# EAGLE design lumiled-example (EAGLE 4.16)
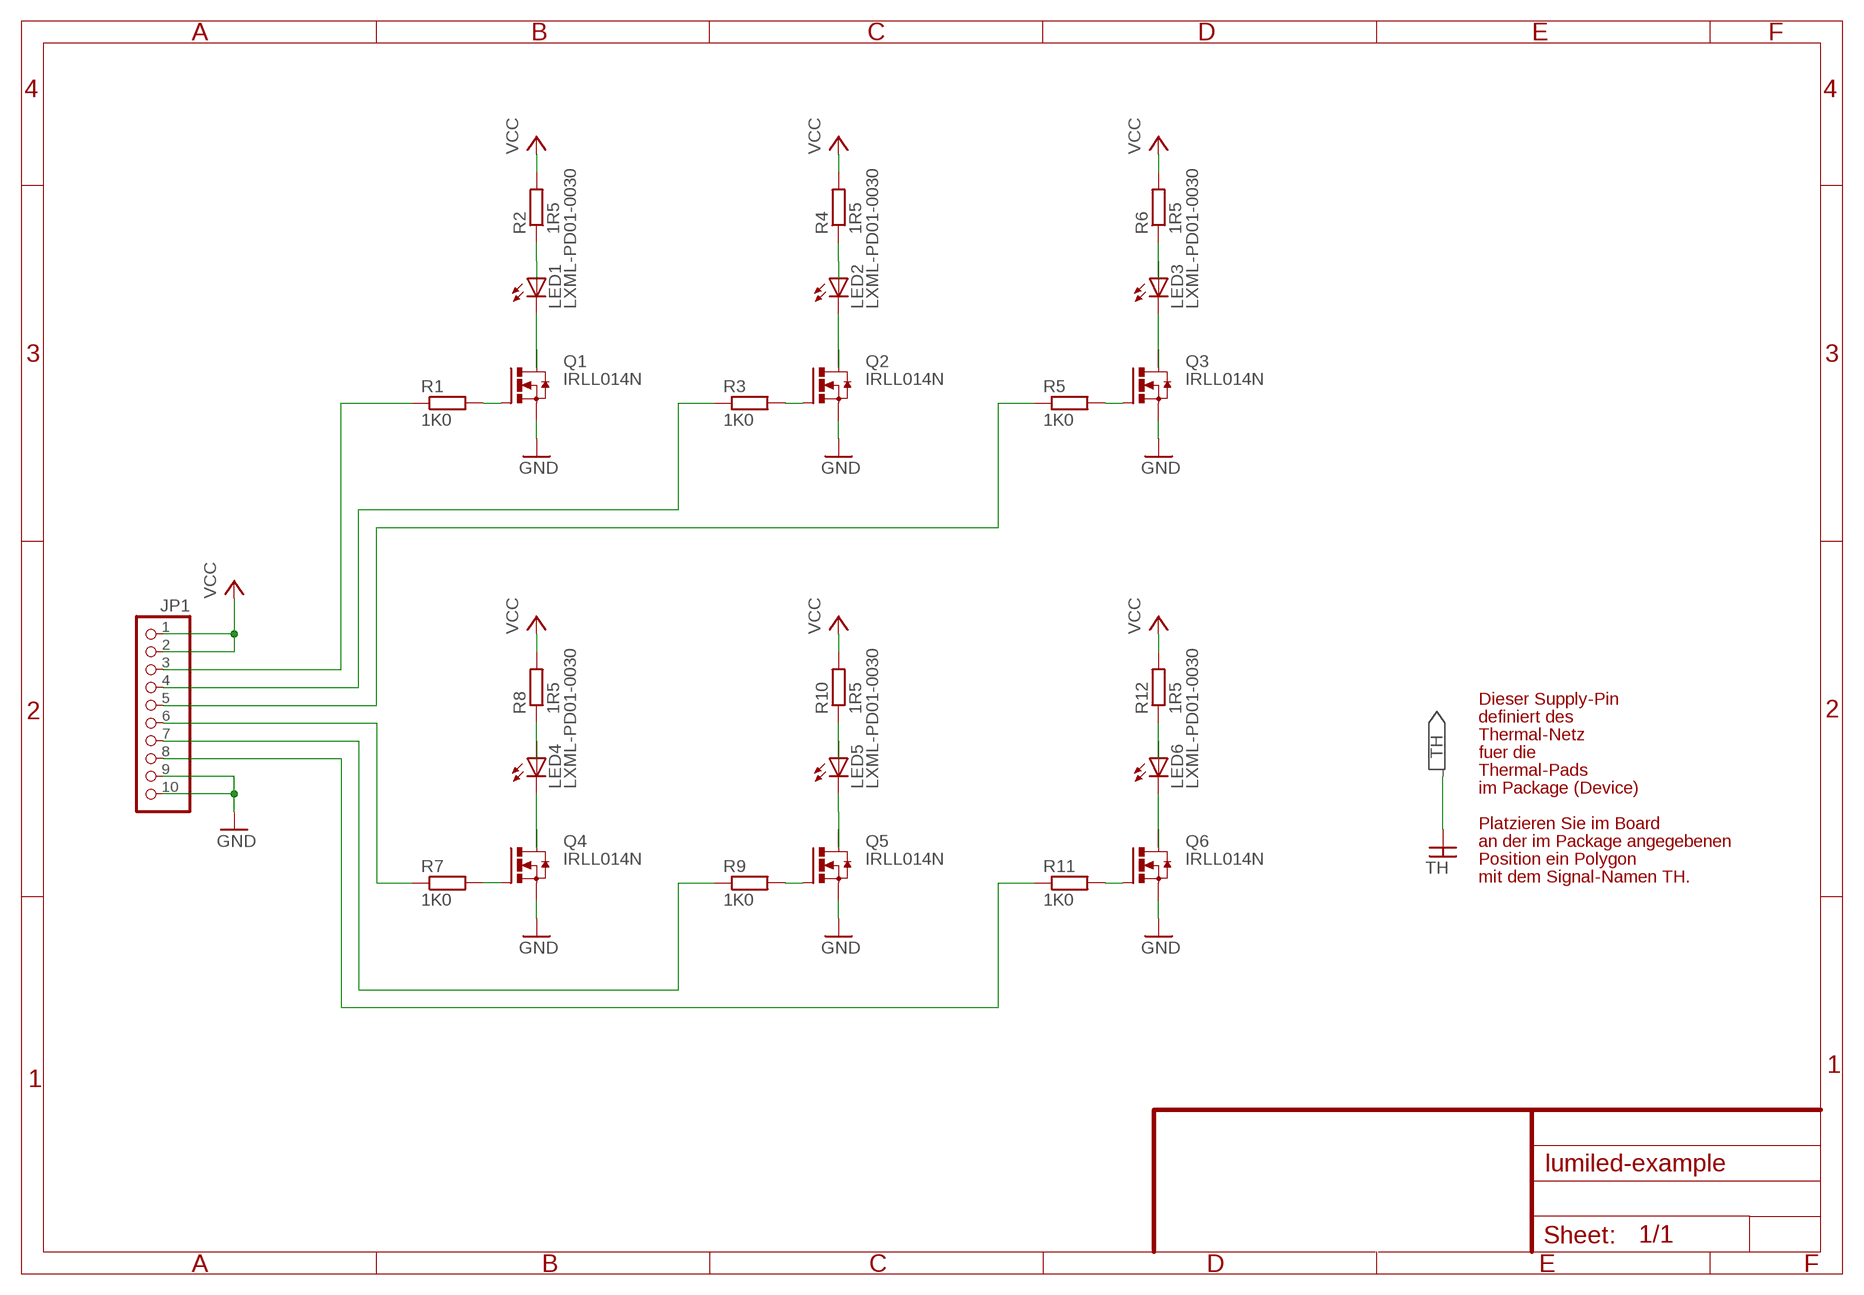
[diagram p0: schematic, sheet 1]

## Parts
JP1  PINHD-1X10  [1X10]
LED1  LXML-PD01-0030  LUXEON_REBEL+COOLPAD  [LUXEON_REBEL+COOLPAD]
LED2  LXML-PD01-0030  LUXEON_REBEL+COOLPAD  [LUXEON_REBEL+COOLPAD]
LED3  LXML-PD01-0030  LUXEON_REBEL+COOLPAD  [LUXEON_REBEL+COOLPAD]
LED4  LXML-PD01-0030  LUXEON_REBEL+COOLPAD  [LUXEON_REBEL+COOLPAD]
LED5  LXML-PD01-0030  LUXEON_REBEL+COOLPAD  [LUXEON_REBEL+COOLPAD]
LED6  LXML-PD01-0030  LUXEON_REBEL+COOLPAD  [LUXEON_REBEL+COOLPAD]
Q1  IRLL014N  N-HEXFET-2D_SOT232-IRLL014N  [SOT223]
Q2  IRLL014N  N-HEXFET-2D_SOT232-IRLL014N  [SOT223]
Q3  IRLL014N  N-HEXFET-2D_SOT232-IRLL014N  [SOT223]
Q4  IRLL014N  N-HEXFET-2D_SOT232-IRLL014N  [SOT223]
Q5  IRLL014N  N-HEXFET-2D_SOT232-IRLL014N  [SOT223]
Q6  IRLL014N  N-HEXFET-2D_SOT232-IRLL014N  [SOT223]
R1  1K0  R-EU_R0603  [R0603]
R2  1R5  R-EU_WSC2515  [WSC2515]
R3  1K0  R-EU_R0603  [R0603]
R4  1R5  R-EU_WSC2515  [WSC2515]
R5  1K0  R-EU_R0603  [R0603]
R6  1R5  R-EU_WSC2515  [WSC2515]
R7  1K0  R-EU_R0603  [R0603]
R8  1R5  R-EU_WSC2515  [WSC2515]
R9  1K0  R-EU_R0603  [R0603]
R10  1R5  R-EU_WSC2515  [WSC2515]
R11  1K0  R-EU_R0603  [R0603]
R12  1R5  R-EU_WSC2515  [WSC2515]

## Nets
GND: JP1.9 JP1.10 Q1.3(S) Q2.3(S) Q3.3(S) Q4.3(S) Q5.3(S) Q6.3(S)
N$1: Q1.1(G) R1.2
N$2: LED1.C LED1.C@1(C) Q1.2(D) Q1.4(D)
N$3: LED1.A LED1.A@1(A) R2.1
N$4: JP1.3 R1.1
N$5: Q2.1(G) R3.2
N$6: LED2.C LED2.C@1(C) Q2.2(D) Q2.4(D)
N$7: LED2.A LED2.A@1(A) R4.1
N$8: JP1.4 R3.1
N$9: Q3.1(G) R5.2
N$10: LED3.C LED3.C@1(C) Q3.2(D) Q3.4(D)
N$11: LED3.A LED3.A@1(A) R6.1
N$12: JP1.5 R5.1
N$13: Q4.1(G) R7.2
N$14: LED4.C LED4.C@1(C) Q4.2(D) Q4.4(D)
N$15: LED4.A LED4.A@1(A) R8.1
N$16: JP1.6 R7.1
N$17: Q5.1(G) R9.2
N$18: LED5.C LED5.C@1(C) Q5.2(D) Q5.4(D)
N$19: LED5.A LED5.A@1(A) R10.1
N$20: JP1.7 R9.1
N$21: Q6.1(G) R11.2
N$22: LED6.C LED6.C@1(C) Q6.2(D) Q6.4(D)
N$23: LED6.A LED6.A@1(A) R12.1
N$24: JP1.8 R11.1
VCC: JP1.1 JP1.2 R2.2 R4.2 R6.2 R8.2 R10.2 R12.2

## Notes on the sheet
- Dieser Supply-Pin
- definiert des
- Thermal-Netz
- fuer die
- Thermal-Pads
- im Package (Device)
- Platzieren Sie im Board
- an der im Package angegebenen
- Position ein Polygon
- mit dem Signal-Namen TH.

## Power pins joined to a net without a drawn wire
TH: LED1.TH LED1.TH@1(TH) LED1.TH@2(TH) LED1.TH@3(TH) LED1.TH@4(TH) LED1.TH@5(TH) LED1.TH@6(TH) LED1.TH@7(TH) LED1.TH@8(TH) LED1.TH@9(TH) LED1.TH@10(TH) LED1.TH@11(TH) LED1.TH@12(TH) LED1.TH@13(TH) LED1.TH@14(TH) LED1.TH@15(TH) LED1.TH@16(TH) LED1.TH@17(TH) LED1.TH@18(TH) LED1.TH@19(TH) LED1.TH@20(TH) LED1.TH@21(TH) LED1.TH@22(TH) LED1.TH@23(TH) LED1.TH@24(TH) LED1.TH@25(TH) LED1.TH@26(TH) LED1.TH@27(TH) LED1.TH@28(TH) LED1.TH@29(TH) LED1.TH@30(TH) LED1.TH@31(TH) LED1.TH@32(TH) LED1.TH@33(TH) LED1.TH@34(TH) LED1.TH@35(TH) LED2.TH LED2.TH@1(TH) LED2.TH@2(TH) LED2.TH@3(TH) LED2.TH@4(TH) LED2.TH@5(TH) LED2.TH@6(TH) LED2.TH@7(TH) LED2.TH@8(TH) LED2.TH@9(TH) LED2.TH@10(TH) LED2.TH@11(TH) LED2.TH@12(TH) LED2.TH@13(TH) LED2.TH@14(TH) LED2.TH@15(TH) LED2.TH@16(TH) LED2.TH@17(TH) LED2.TH@18(TH) LED2.TH@19(TH) LED2.TH@20(TH) LED2.TH@21(TH) LED2.TH@22(TH) LED2.TH@23(TH) LED2.TH@24(TH) LED2.TH@25(TH) LED2.TH@26(TH) LED2.TH@27(TH) LED2.TH@28(TH) LED2.TH@29(TH) LED2.TH@30(TH) LED2.TH@31(TH) LED2.TH@32(TH) LED2.TH@33(TH) LED2.TH@34(TH) LED2.TH@35(TH) LED3.TH LED3.TH@1(TH) LED3.TH@2(TH) LED3.TH@3(TH) LED3.TH@4(TH) LED3.TH@5(TH) LED3.TH@6(TH) LED3.TH@7(TH) LED3.TH@8(TH) LED3.TH@9(TH) LED3.TH@10(TH) LED3.TH@11(TH) LED3.TH@12(TH) LED3.TH@13(TH) LED3.TH@14(TH) LED3.TH@15(TH) LED3.TH@16(TH) LED3.TH@17(TH) LED3.TH@18(TH) LED3.TH@19(TH) LED3.TH@20(TH) LED3.TH@21(TH) LED3.TH@22(TH) LED3.TH@23(TH) LED3.TH@24(TH) LED3.TH@25(TH) LED3.TH@26(TH) LED3.TH@27(TH) LED3.TH@28(TH) LED3.TH@29(TH) LED3.TH@30(TH) LED3.TH@31(TH) LED3.TH@32(TH) LED3.TH@33(TH) LED3.TH@34(TH) LED3.TH@35(TH) LED4.TH LED4.TH@1(TH) LED4.TH@2(TH) LED4.TH@3(TH) LED4.TH@4(TH) LED4.TH@5(TH) LED4.TH@6(TH) LED4.TH@7(TH) LED4.TH@8(TH) LED4.TH@9(TH) LED4.TH@10(TH) LED4.TH@11(TH) LED4.TH@12(TH) LED4.TH@13(TH) LED4.TH@14(TH) LED4.TH@15(TH) LED4.TH@16(TH) LED4.TH@17(TH) LED4.TH@18(TH) LED4.TH@19(TH) LED4.TH@20(TH) LED4.TH@21(TH) LED4.TH@22(TH) LED4.TH@23(TH) LED4.TH@24(TH) LED4.TH@25(TH) LED4.TH@26(TH) LED4.TH@27(TH) LED4.TH@28(TH) LED4.TH@29(TH) LED4.TH@30(TH) LED4.TH@31(TH) LED4.TH@32(TH) LED4.TH@33(TH) LED4.TH@34(TH) LED4.TH@35(TH) LED5.TH LED5.TH@1(TH) LED5.TH@2(TH) LED5.TH@3(TH) LED5.TH@4(TH) LED5.TH@5(TH) LED5.TH@6(TH) LED5.TH@7(TH) LED5.TH@8(TH) LED5.TH@9(TH) LED5.TH@10(TH) LED5.TH@11(TH) LED5.TH@12(TH) LED5.TH@13(TH) LED5.TH@14(TH) LED5.TH@15(TH) LED5.TH@16(TH) LED5.TH@17(TH) LED5.TH@18(TH) LED5.TH@19(TH) LED5.TH@20(TH) LED5.TH@21(TH) LED5.TH@22(TH) LED5.TH@23(TH) LED5.TH@24(TH) LED5.TH@25(TH) LED5.TH@26(TH) LED5.TH@27(TH) LED5.TH@28(TH) LED5.TH@29(TH) LED5.TH@30(TH) LED5.TH@31(TH) LED5.TH@32(TH) LED5.TH@33(TH) LED5.TH@34(TH) LED5.TH@35(TH) LED6.TH LED6.TH@1(TH) LED6.TH@2(TH) LED6.TH@3(TH) LED6.TH@4(TH) LED6.TH@5(TH) LED6.TH@6(TH) LED6.TH@7(TH) LED6.TH@8(TH) LED6.TH@9(TH) LED6.TH@10(TH) LED6.TH@11(TH) LED6.TH@12(TH) LED6.TH@13(TH) LED6.TH@14(TH) LED6.TH@15(TH) LED6.TH@16(TH) LED6.TH@17(TH) LED6.TH@18(TH) LED6.TH@19(TH) LED6.TH@20(TH) LED6.TH@21(TH) LED6.TH@22(TH) LED6.TH@23(TH) LED6.TH@24(TH) LED6.TH@25(TH) LED6.TH@26(TH) LED6.TH@27(TH) LED6.TH@28(TH) LED6.TH@29(TH) LED6.TH@30(TH) LED6.TH@31(TH) LED6.TH@32(TH) LED6.TH@33(TH) LED6.TH@34(TH) LED6.TH@35(TH)

## Library data of the parts
JP1 = pinhead:PINHD-1X10: PIN HEADER
LED1-LED6 = led-lumiled:LUXEON_REBEL+COOLPAD: LUXEON REBEL LED with cooling pads Display Layer Refence in Board for more information Stop and Cream Mask defined by Luxeon Rebel Footprint _customer.dxf
Q1-Q6 = transistor-power:N-HEXFET-2D_?-*: HEXFET® Power MOSFET 2 Drain connects http://www.irf.com/product-info/datasheets/data/irll014n.pdf
R1-R12 = rcl:R-EU_: RESISTOR, European symbol

## Net classes
0 default: width 0.3 mm, drill 0.3 mm, clearance 0.2 mm

## Board
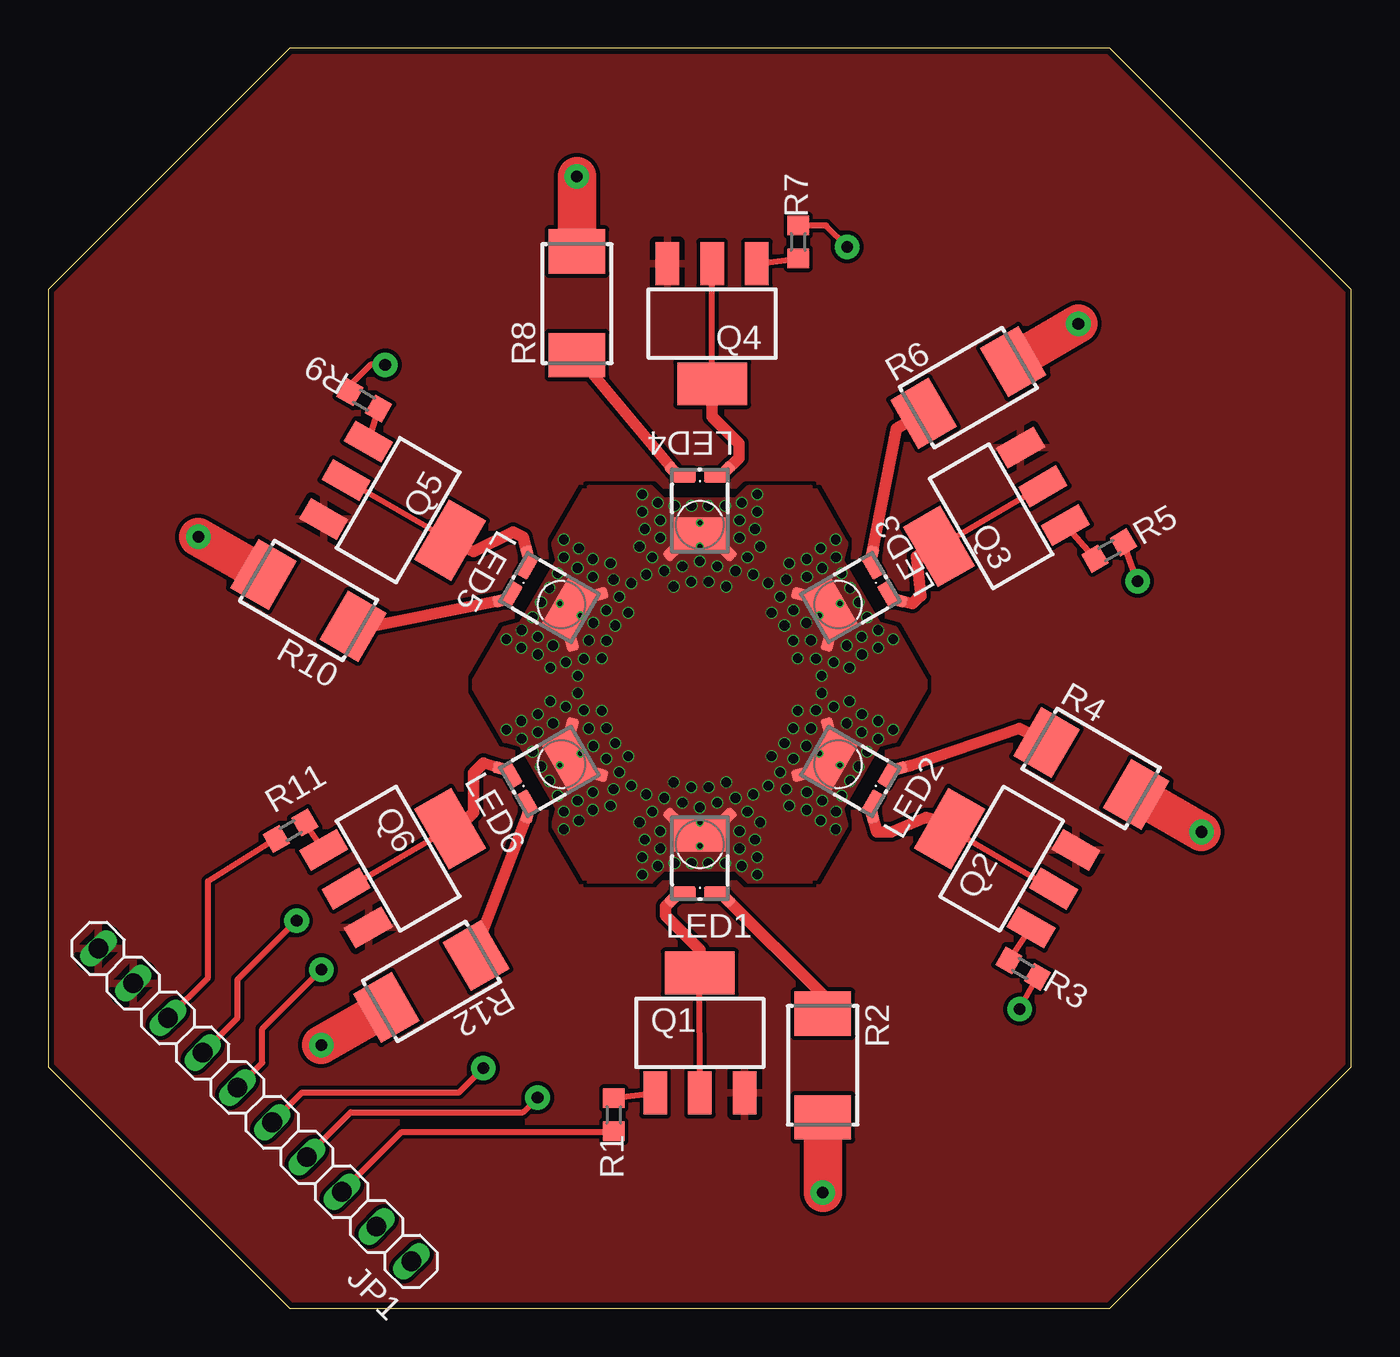
[diagram p1: board, top side]
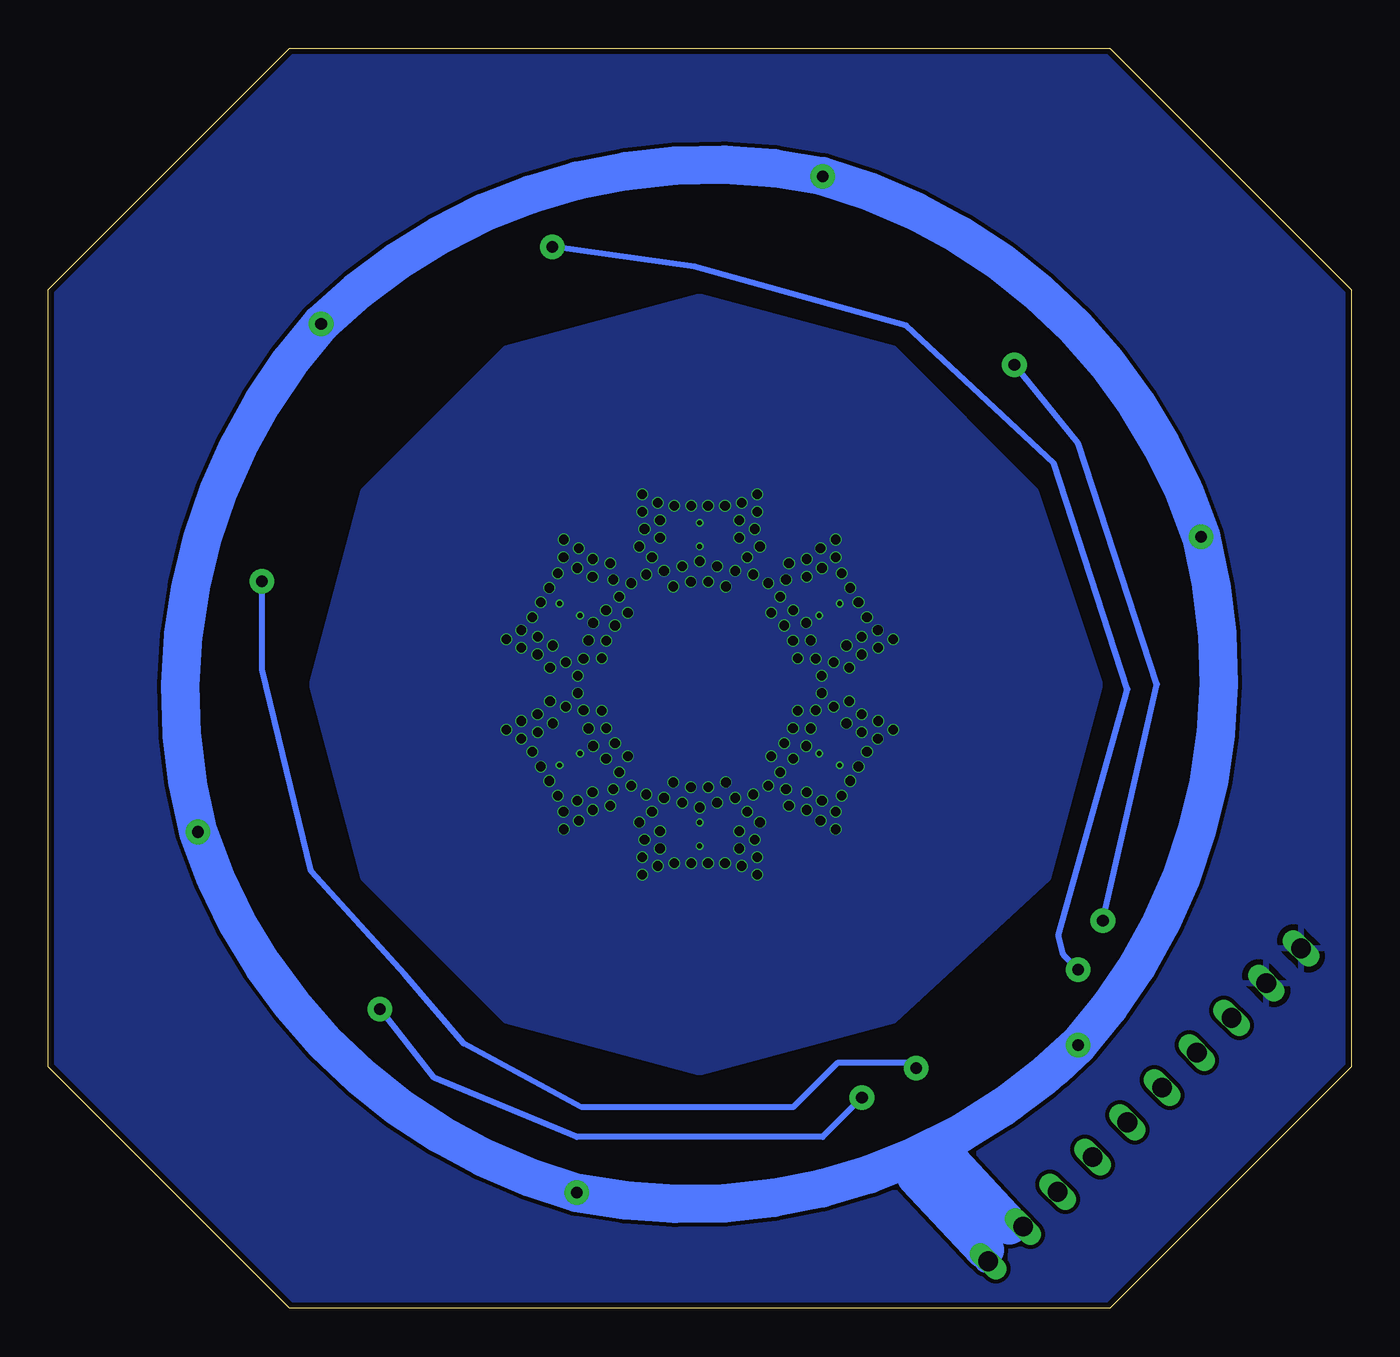
[diagram p2: board, bottom side, seen from below]

Size 67.29 x 65.08 mm. Coordinates in mm from the lower left corner, seen from the top.
Outline: 12.46,65.08 0,52.61 0,12.46 12.46,0 54.83,0 67.29,12.46 67.29,52.61 54.83,65.08 12.46,65.08
Copper layers ([1+[2*15+16:15]:2]): Top 0.035mm / dielectric 0.2mm / Route2 0.035mm / dielectric 0.5mm / Route15 0.035mm / dielectric 0.2mm / Bottom 0.035mm
Design rules "default": minimum track width 0.1mm, minimum drill 0.2mm, track to track 8mil, track to pad 8mil, pad to pad 8mil, via to via 8mil, smd to smd 0mil, copper to edge 0.3mm, drill to drill 0.3mm, minimum pad ring 0.05mm, minimum via ring 0.05mm, stop-mask expansion 4mil, vias tented up to drill 0mil, thermal gap 0.3mm

### Footprints (pad centres in the part's own frame; a part is rotated, then mirrored left to right if it is on the bottom)
1X10 = drill 1.016 long: 1 -11.43,0; 2 -8.89,0; 3 -6.35,0; 4 -3.81,0; 5 -1.27,0; 6 1.27,0; 7 3.81,0; 8 6.35,0; 9 8.89,0; 10 11.43,0
LUXEON_REBEL+COOLPAD = smd 1.2 x 0.67: A 0.8,-2.51; C -0.8,-2.51 | smd 1 x 0.6 rotated 315: A@1 1.31,-2.75 | smd 1 x 0.6 rotated 225: C@1 -1.31,-2.75 | smd 2.8 x 1.77: TH 0,0.51 | smd 1 x 0.6 rotated 135: TH@1 -1.39,1.39 | smd 1 x 0.6 rotated 45: TH@2 1.39,1.39 | drill 0.5 pad 0.6 round: TH@3 2.971,-1.57; TH@4 2.971,-0.67; TH@5 2.85,0.23; TH@6 2.05,0.68; TH@7 2.05,-0.22; TH@8 2.171,-1.12; TH@9 2.764,2.575; TH@10 3.116,1.13; TH@11 2.461,1.687; TH@12 1.844,2.394; TH@13 0.9,2.15; TH@14 0,1.9; TH@15 0.45,2.95; TH@16 1.356,3.196; TH@17 1.31,-0.97; TH@18 0.43,-0.97; TH@21 -2.971,-1.57; TH@22 -2.971,-0.67; TH@23 -2.85,0.23; TH@24 -2.05,0.68; TH@25 -2.05,-0.22; TH@26 -2.171,-1.12; TH@27 -2.764,2.575; TH@28 -3.116,1.13; TH@29 -2.461,1.687; TH@30 -1.844,2.394; TH@31 -0.9,2.15; TH@32 -0.45,2.95; TH@33 -1.356,3.196; TH@34 -1.31,-0.97; TH@35 -0.43,-0.97 | drill 0.25 pad 0.4 round: TH@19 0,-0.095; TH@20 0,1.125
SOT223 = smd 1.219 x 2.235: 1 -2.311,-3.099; 2 0,-3.099; 3 2.311,-3.099 | smd 3.6 x 2.2: 4 0,3.099
R0603 = smd 1 x 1.1: 1 -0.85,0; 2 0.85,0
WSC2515 = smd 2.29 x 2.92: 1 -2.675,0; 2 2.675,0

### Placement (x,y rotation side)
JP1  10.66,10.5 135 top
LED1  33.65,23.97 0 top
LED2  40.8,28.09 60 top
LED3  40.8,36.35 120 top
LED4  33.65,40.48 180 top
LED5  26.5,36.35 240 top
LED6  26.5,28.09 300 top
Q1  33.65,14.22 0 top
Q2  49.24,23.22 60 top
Q3  48.69,40.9 120 top
Q4  34.29,50.86 180 top
Q5  18.06,41.22 240 top
Q6  18.06,23.22 300 top
R1  29.2,10 90 top
R2  40,12.54 270 top
R3  50.35,17.55 150 top
R4  53.87,27.88 330 top
R5  54.79,39.14 210 top
R6  47.52,47.56 30 top
R7  38.73,55.08 270 top
R8  27.3,51.91 90 top
R9  16.32,46.89 330 top
R10  13.43,36.56 150 top
R11  12.51,24.67 30 top
R12  19.78,16.88 210 top

### Tracks (layer width: path | path; a pad name or v marks a point on that pad's centre or on a via)
GND
  pour Top (rank 6): -3.18,-3.59 -3.18,67.78 70.73,67.78 70.73,-3.59
  pour Bottom (rank 6): -3.43,-3.59 -3.43,68.03 70.48,67.78 70.73,-3.59
N$1
  Top 0.3: R1.2 29.24,10.86 Q1.1
N$2
  Top 0.3: Q1.4 33.64,17.34 Q1.2 | LED1.C LED1.C@1
  Top 0.6: LED1.C@1 31.87,20.75 31.87,20.28 33.65,18.5 Q1.4 33.65,17.23
N$3
  Top 0.3: LED1.A@1 34.98,21.22 LED1.A
  Top 0.6: R2.1 40,16.18 LED1.A@1
N$4
  Top 0.3: JP1.3 18.25,9.11 29.17,9.11 R1.1
N$5
  Top 0.3: R3.2 49.63,17.99 Q2.1
N$6
  Top 0.3: Q2.4 46.55,24.78 Q2.2 | LED2.C LED2.C@1
  Top 0.6: LED2.C@1 42.79,24.6 43.56,24.6 45.33,25.36 46.1,25.11 46.35,24.85 46.35,24.77 Q2.4
N$7
  Top 0.3: LED2.A@1 LED2.A
  Top 0.6: LED2.A@1 44.54,28.04 50.16,29.93 51.18,29.43 51.43,29.17 51.43,29.21 R4.1
N$8  (via drill 0.6 pad 1.27)
  Top 0.3: JP1.4 13.36,7.86 15.62,10.12 24.51,10.12 v25.27,10.88 | v50.16,15.46 R3.1
  Bottom 0.3: v25.27,10.88 27.3,8.85 40,8.85 47.37,11.9 v50.16,15.46
N$9
  Top 0.3: R5.2 Q3.1
N$10
  Top 0.3: Q3.2 51.18,42.38 Q3.4 | LED3.C@1 43.83,36.6 LED3.C
  Top 0.6: LED3.C@1 44.62,36.39 45.08,36.85 45.08,36.79 44.83,38.82 45.59,39.33 46.1,39.33 Q3.4
N$11
  Top 0.3: LED3.A LED3.A@1
  Top 0.6: LED3.A@1 43.81,45.43 R6.1
N$12  (via drill 0.6 pad 1.27)
  Top 0.3: JP1.5 13.09,11.14 21.2,11.14 v22.47,12.41 | v56.26,37.55 R5.1
  Bottom 0.3: v22.47,12.41 22.73,12.66 26.54,12.66 28.82,10.38 39.75,10.38 45.84,13.68 48.89,17.23 53.72,22.57 56.26,32.98 v56.26,37.55
N$13
  Top 0.3: R7.2 38.73,54.2 Q4.1
N$14
  Top 0.3: Q4.4 34.29,53.94 34.29,53.93 Q4.2 | LED4.C@1 34.97,43.25 LED4.C
  Top 0.6: LED4.C@1 35.68,43.9 35.68,44.67 34.29,46.06 Q4.4
N$15
  Top 0.3: LED4.A 32.84,42.99 LED4.A@1
  Top 0.6: R8.1 LED4.A@1
N$16  (via drill 0.6 pad 1.27)
  Top 0.3: JP1.6 11.04,12.68 11.04,14.44 v14.09,17.49 | R7.1 40.17,55.93 v41.27,54.83
  Bottom 0.3: v14.09,17.49 14.85,18.25 15.11,19.27 11.55,31.97 15.36,43.65 22.98,50.76 33.9,53.81 v41.27,54.83
N$17
  Top 0.3: R9.2 Q5.1
N$18
  Top 0.3: Q5.2 Q5.4 | LED5.C LED5.C@1
  Top 0.6: LED5.C@1 24.51,39.84 24,40.09 21.97,39.08 arc-8 Q5.4
N$19
  Top 0.3: LED5.A 23.9,36.89 LED5.A@1
  Top 0.6: R10.1 15.62,35.01 LED5.A@1
N$20  (via drill 0.6 pad 1.27)
  Top 0.3: JP1.7 9.77,15 9.77,16.98 v12.82,20.03 | R9.1 15.58,47.68 16.63,48.73 v17.39,48.73
  Bottom 0.3: v12.82,20.03 10.03,32.22 14.09,44.67 v17.39,48.73
N$21
  Top 0.3: R11.2 13.26,25.07 Q6.1
N$22
  Top 0.3: Q6.4 20.73,24.79 Q6.2 | LED6.C LED6.C@1
  Top 0.6: LED6.C@1 22.47,28.16 21.97,27.65 21.97,25.62 21.12,24.77 Q6.4
N$23
  Top 0.3: LED6.A LED6.A@1
  Top 0.6: R12.1 21.97,18.25 LED6.A@1
N$24
  Top 0.3: JP1.8 8.25,17.07 8.25,22.06 11.7,24.24 R11.1
TH
  pour Top (no thermals): 32.38,32.22 34.92,32.22 39.37,22.06 36.19,22.06 35.55,22.7 31.75,22.7 31.11,22.06 27.94,22.06
  pour Bottom (no thermals): 53.65,32.22 50.97,42.22 43.65,49.54 33.65,52.22 23.65,49.54 16.33,42.22 13.02,32.22 15.69,22.22 23.65,14.9 33.65,12.22 43.65,14.9 50.97,22.22
  pour Top (no thermals): 34.29,33.32 33.02,31.12 21.99,32.35 23.58,35.1 24.45,35.33 26.35,38.63 26.12,39.5 27.71,42.25
  pour Top (no thermals): 33.02,33.32 34.29,31.12 27.71,22.19 26.12,24.94 26.35,25.81 24.45,29.11 23.58,29.34 21.99,32.09
  pour Top (no thermals): 34.29,31.12 33.02,33.32 39.59,42.25 41.18,39.5 40.95,38.63 42.85,35.33 43.72,35.1 45.31,32.35
  pour Top (no thermals): 33.02,31.12 34.29,33.32 45.31,32.09 43.72,29.34 42.85,29.11 40.95,25.81 41.18,24.94 39.59,22.19
  pour Top (no thermals): 34.92,32.22 32.38,32.22 27.94,42.38 31.11,42.38 31.75,41.75 35.55,41.75 36.19,42.38 39.37,42.38
VCC  (via drill 0.6 pad 1.27)
  Top 0.3: R4.2 | R2.2 | R2.2 | R12.2 17.47,15.54 R12.2 | R10.2 | R10.2 | R8.2 | 49.85,48.89 R6.2 49.85,48.89
  Top 2: v40.01,5.97 R2.2 | v7.74,39.84 R10.2 | v27.3,58.47 R8.2 | v53.2,50.85 R6.2 | v59.56,24.6 R4.2 | v14.1,13.59 R12.2 v14.1,13.59
  Bottom 0.3: 18.92,2.76 19.17,2.76 17.65,4.28
  Bottom 1: JP1.2 17.27,4.28 17.65,4.28 | JP1.1 18.92,2.34 18.92,2.76 18.92,3.01
  Bottom 2: 18.92,3.01 22.47,6.82 | 17.65,4.28 20.95,7.84 20.95,8.6 20.44,8.85 17.65,10.63 15.36,12.41 v14.1,13.59 arc56 v40.01,5.97 arc56 v59.56,24.6 arc56 v53.2,50.85 arc56 v27.3,58.47 arc56 v7.74,39.84 arc56 v14.1,13.59